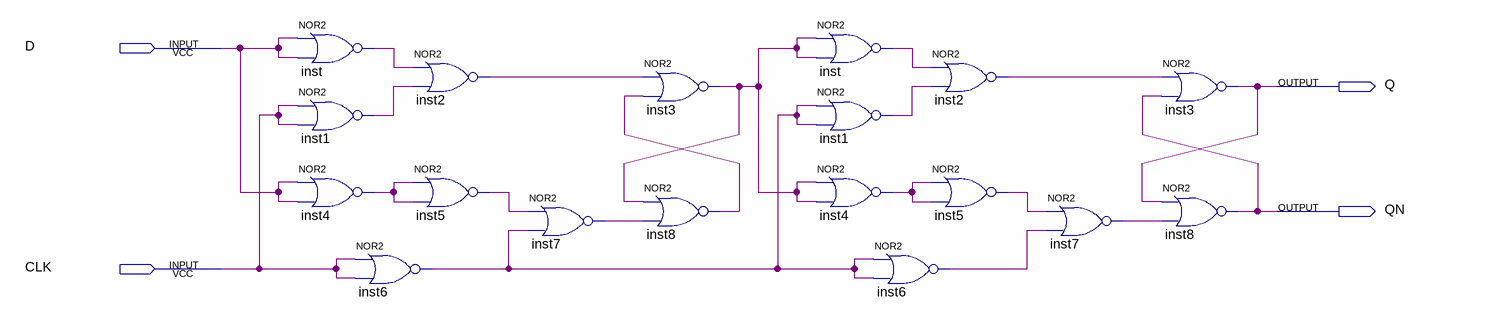
[diagram p0: schematic sheet]
// Quartus schematic hw3-3.bdf as structural Verilog: 18 symbols, 4 pins
module \hw3-3  (
  input  D,
  input  CLK,
  output Q,
  output QN
);

  wire inst1_out, inst1_out_2, inst2_out, inst2_out_2, inst3_out, inst4_out, inst4_out_2, inst5_out,
       inst5_out_2, inst6_out, inst6_out_2, inst7_out, inst7_out_2, inst8_out, inst_out, inst_out_2;

  nor inst (inst_out, D, D);
  nor inst1 (inst1_out, CLK, CLK);
  nor inst4 (inst4_out, D, D);
  nor inst2 (inst2_out, inst_out, inst1_out);
  nor inst5 (inst5_out, inst4_out, inst4_out);
  nor inst6 (inst6_out, CLK, CLK);
  nor inst7 (inst7_out, inst5_out, inst6_out);
  nor inst3 (inst3_out, inst2_out, inst8_out);
  nor inst8 (inst8_out, inst3_out, inst7_out);
  nor inst_dup2 (inst_out_2, inst3_out, inst3_out);
  nor inst1_dup2 (inst1_out_2, inst6_out, inst6_out);
  nor inst4_dup2 (inst4_out_2, inst3_out, inst3_out);
  nor inst6_dup2 (inst6_out_2, inst6_out, inst6_out);
  nor inst2_dup2 (inst2_out_2, inst_out_2, inst1_out_2);
  nor inst5_dup2 (inst5_out_2, inst4_out_2, inst4_out_2);
  nor inst7_dup2 (inst7_out_2, inst5_out_2, inst6_out_2);
  nor inst3_dup2 (Q, inst2_out_2, QN);
  nor inst8_dup2 (QN, Q, inst7_out_2);
endmodule
